# EAGLE design XOR (EAGLE 7.1.0)
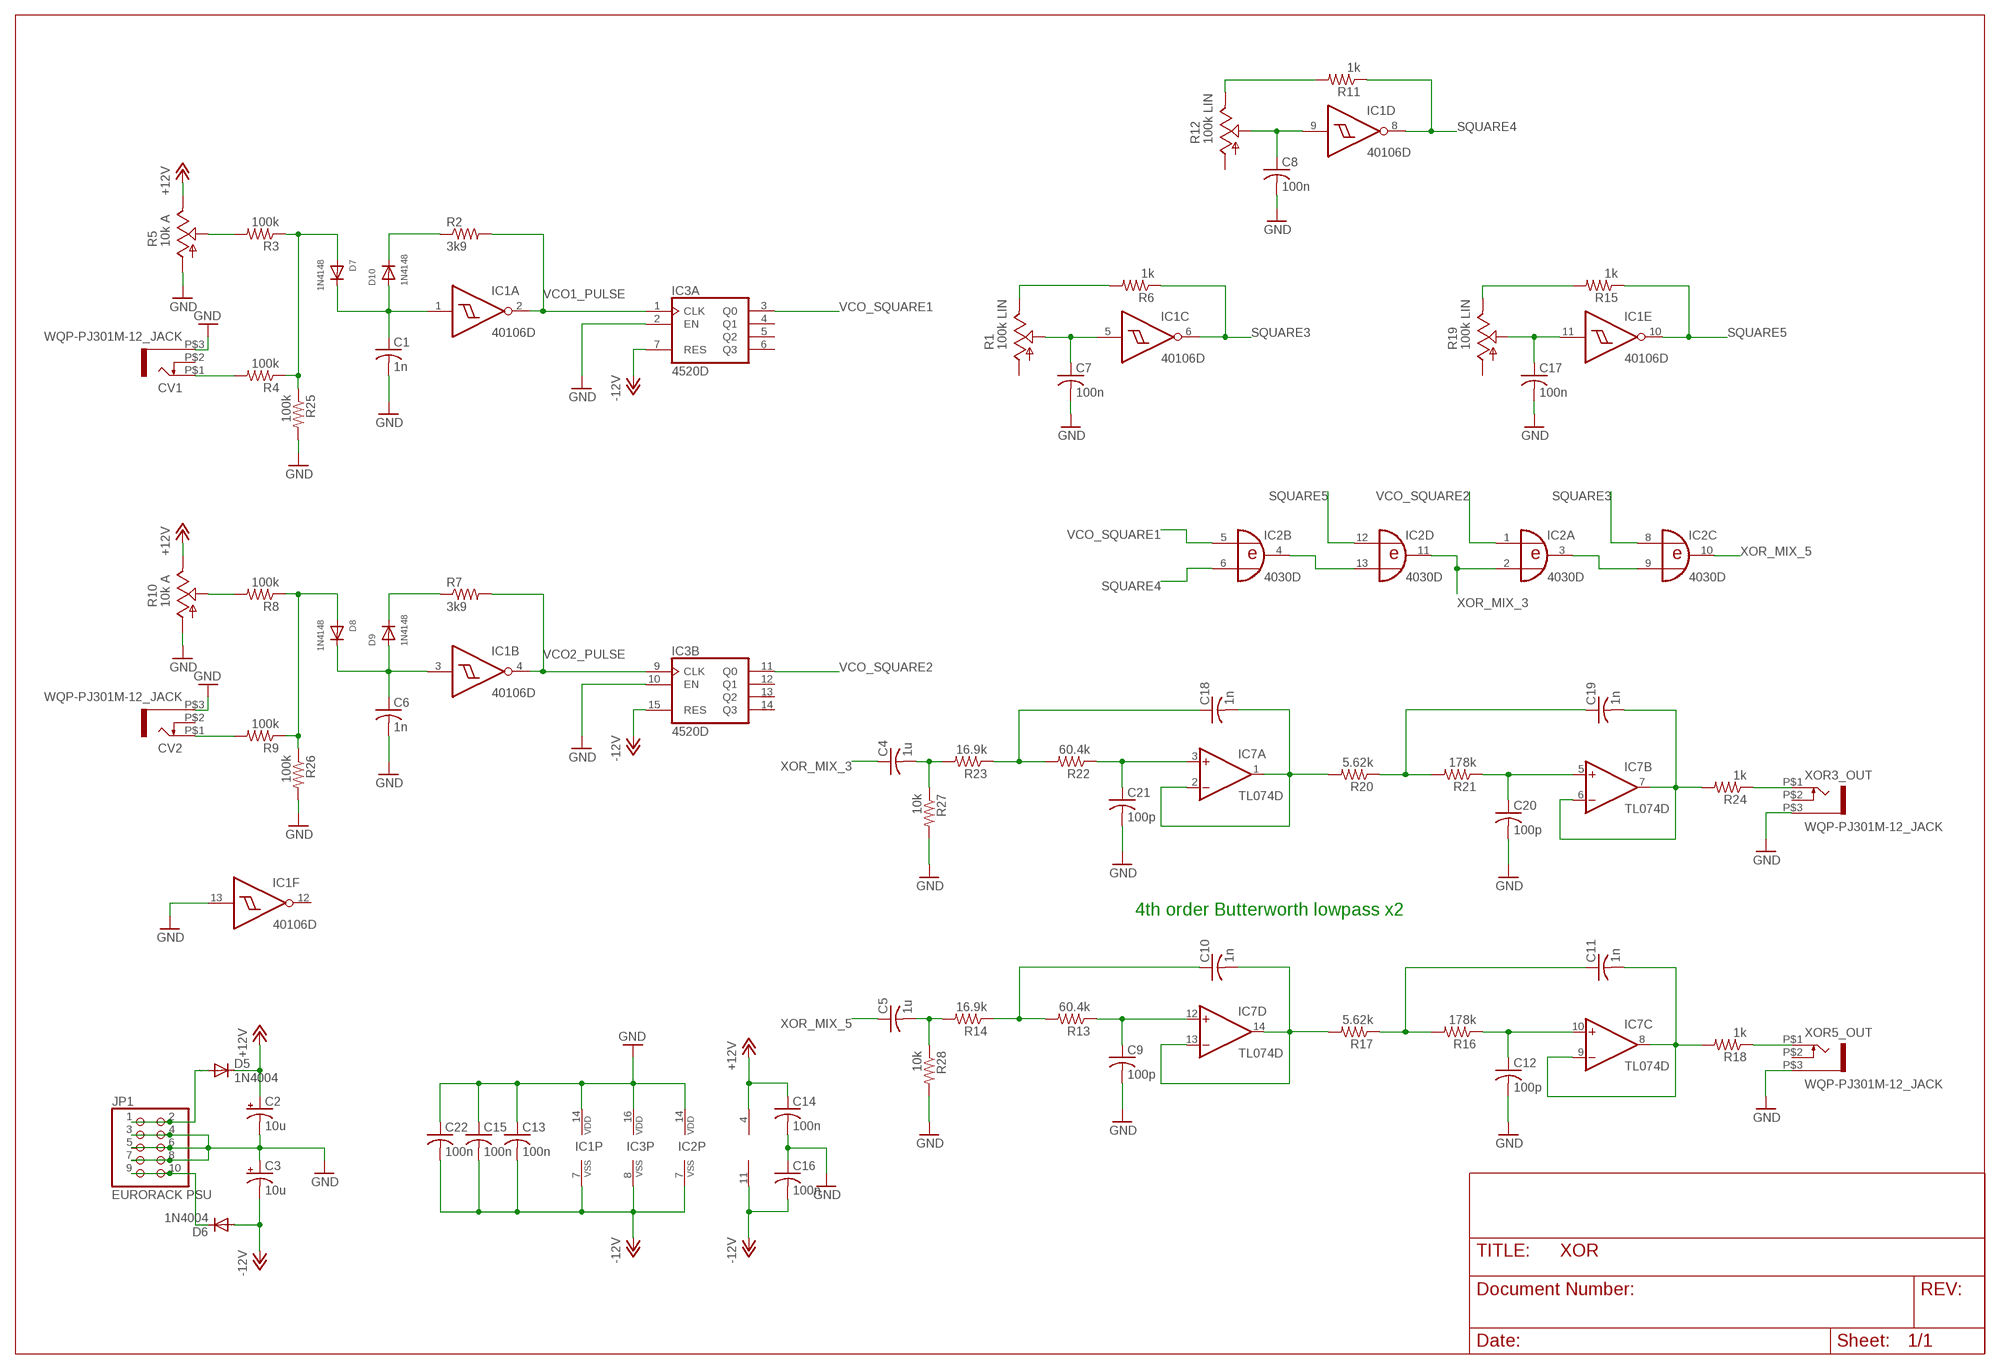
[diagram p0: schematic, sheet 1]

## Parts
C1  1n  C-USC0603K  [C0603K]
C2  10u  CPOL-USD  [PANASONIC_D]
C3  10u  CPOL-USD  [PANASONIC_D]
C4  1u  C-USC0603K  [C0603K]
C5  1u  C-USC0603K  [C0603K]
C6  1n  C-USC0603K  [C0603K]
C7  100n  C-USC0603K  [C0603K]
C8  100n  C-USC0603K  [C0603K]
C9  100p  C-USC0603K  [C0603K]
C10  1n  C-USC0603K  [C0603K]
C11  1n  C-USC0603K  [C0603K]
C12  100p  C-USC0603K  [C0603K]
C13  100n  C-USC0603K  [C0603K]
C14  100n  C-USC0603K  [C0603K]
C15  100n  C-USC0603K  [C0603K]
C16  100n  C-USC0603K  [C0603K]
C17  100n  C-USC0603K  [C0603K]
C18  1n  C-USC0603K  [C0603K]
C19  1n  C-USC0603K  [C0603K]
C20  100p  C-USC0603K  [C0603K]
C21  100p  C-USC0603K  [C0603K]
C22  100n  C-USC0603K  [C0603K]
CV1  WQP-PJ301M-12_JACK  [WQP-PJ301M-12_JACK]
CV2  WQP-PJ301M-12_JACK  [WQP-PJ301M-12_JACK]
D5  1N4004  DIODE-DO214AA  [DO214AA]
D6  1N4004  DIODE-DO214AA  [DO214AA]
D7  1N4148  DIODESOD-323F  [SOD-323F]
D8  1N4148  DIODESOD-323F  [SOD-323F]
D9  1N4148  DIODESOD-323F  [SOD-323F]
D10  1N4148  DIODESOD-323F  [SOD-323F]
IC1  40106D  [SO14]
IC2  4030D  [SO14]
IC3  4520D  [SO16]
IC7  TL074D  [SO14]
JP1  EURORACK PSU  PINHD-2X5  [2X05]
R1  100k LIN  POT_USVERTICAL  [ALPS_POT_VERTICAL]
R2  3k9  R-US_R0603  [R0603]
R3  100k  R-US_R0603  [R0603]
R4  100k  R-US_R0603  [R0603]
R5  10k A  POT_USVERTICAL  [ALPS_POT_VERTICAL]
R6  1k  R-US_R0603  [R0603]
R7  3k9  R-US_R0603  [R0603]
R8  100k  R-US_R0603  [R0603]
R9  100k  R-US_R0603  [R0603]
R10  10k A  POT_USVERTICAL  [ALPS_POT_VERTICAL]
R11  1k  R-US_R0603  [R0603]
R12  100k LIN  POT_USVERTICAL  [ALPS_POT_VERTICAL]
R13  60.4k  R-US_R0603  [R0603]
R14  16.9k  R-US_R0603  [R0603]
R15  1k  R-US_R0603  [R0603]
R16  178k  R-US_R0603  [R0603]
R17  5.62k  R-US_R0603  [R0603]
R18  1k  R-US_R0603  [R0603]
R19  100k LIN  POT_USVERTICAL  [ALPS_POT_VERTICAL]
R20  5.62k  R-US_R0603  [R0603]
R21  178k  R-US_R0603  [R0603]
R22  60.4k  R-US_R0603  [R0603]
R23  16.9k  R-US_R0603  [R0603]
R24  1k  R-US_R0603  [R0603]
R25  100k  R-US_R0603  [R0603]
R26  100k  R-US_R0603  [R0603]
R27  10k  R-US_R0603  [R0603]
R28  10k  R-US_R0603  [R0603]
XOR3_OUT  WQP-PJ301M-12_JACK  [WQP-PJ301M-12_JACK]
XOR5_OUT  WQP-PJ301M-12_JACK  [WQP-PJ301M-12_JACK]

## Nets
+12V: C2.+ C14.1 D5.C IC7.4(P:V+) R5.P$1(E) R10.P$1(E)
-12V: C3.- C13.2 C15.2 C16.2 C22.2 D6.A IC1.7(P:VSS) IC2.7(P:VSS) IC3.7(A:RES) IC3.8(P:VSS) IC3.15(B:RES) IC7.11(P:V-)
GND: C1.2 C2.- C3.+ C6.2 C7.2 C8.2 C9.2 C12.2 C13.1 C14.2 C15.1 C16.1 C17.2 C20.2 C21.2 C22.1 CV1.P$3 CV2.P$3 IC1.13(F:I) IC1.14(P:VDD) IC2.14(P:VDD) IC3.2(A:EN) IC3.10(B:EN) IC3.16(P:VDD) JP1.3 JP1.4 JP1.5 JP1.6 JP1.7 JP1.8 R5.P$3(A) R10.P$3(A) R25.2 R26.2 R27.2 R28.2 XOR3_OUT.P$3 XOR5_OUT.P$3
N$1: R3.2 R5.P$2(S)
N$2: CV1.P$1 R4.2
N$3: D7.A R3.1 R4.1 R25.1
N$4: C1.1 D7.C D10.A IC1.1(A:I)
N$5: D10.C R2.1
N$6: R1.P$1(E) R6.2
N$7: R8.2 R10.P$2(S)
N$8: D6.C JP1.9 JP1.10
N$9: D5.A JP1.1 JP1.2
N$10: IC2.3(A:O) IC2.9(C:I1)
N$12: R11.2 R12.P$1(E)
N$13: C6.1 D8.C D9.A IC1.3(B:I)
N$14: C7.1 IC1.5(C:I) R1.P$2(S)
N$15: D9.C R7.1
N$16: C12.1 IC7.10(C:+IN) R16.1
N$17: D8.A R8.1 R9.1 R26.1
N$18: C10.2 IC7.13(D:-IN) IC7.14(D:OUT) R17.2
N$19: CV2.P$1 R9.2
N$20: C8.1 IC1.9(D:I) R12.P$2(S)
N$21: C10.1 R13.2 R14.1
N$22: C9.1 IC7.12(D:+IN) R13.1
N$23: R18.1 XOR5_OUT.P$1
N$24: C17.1 IC1.11(E:I) R19.P$2(S)
N$25: IC2.4(B:O) IC2.13(D:I1)
N$26: R15.2 R19.P$1(E)
N$28: C18.1 R22.2 R23.1
N$29: C18.2 IC7.1(A:OUT) IC7.2(A:-IN) R20.2
N$30: C21.1 IC7.3(A:+IN) R22.1
N$31: C11.1 R16.2 R17.1
N$32: C11.2 IC7.8(C:OUT) IC7.9(C:-IN) R18.2
N$33: C4.2 R23.2 R27.1
N$34: C19.1 R20.1 R21.2
N$35: C20.1 IC7.5(B:+IN) R21.1
N$36: C19.2 IC7.6(B:-IN) IC7.7(B:OUT) R24.2
N$37: R24.1 XOR3_OUT.P$1
N$38: C5.2 R14.2 R28.1
SQUARE3: IC1.6(C:O) IC2.8(C:I0) R6.1
SQUARE4: IC1.8(D:O) IC2.6(B:I1) R11.1
SQUARE5: IC1.10(E:O) IC2.12(D:I0) R15.1
VCO1_PULSE: IC1.2(A:O) IC3.1(A:CLK) R2.2
VCO2_PULSE: IC1.4(B:O) IC3.9(B:CLK) R7.2
VCO_SQUARE1: IC2.5(B:I0) IC3.3(A:Q0)
VCO_SQUARE2: IC2.1(A:I0) IC3.11(B:Q0)
XOR_MIX_3: C4.1 IC2.2(A:I1) IC2.11(D:O)
XOR_MIX_5: C5.1 IC2.10(C:O)
Unconnected: CV1.P$2 CV2.P$2 IC1.12(F:O) IC3.4(A:Q1) IC3.5(A:Q2) IC3.6(A:Q3) IC3.12(B:Q1) IC3.13(B:Q2) IC3.14(B:Q3) R1.P$3(A) R12.P$3(A) R19.P$3(A) XOR3_OUT.P$2 XOR5_OUT.P$2

## Notes on the sheet
- 4th order Butterworth lowpass x2

## Library data of the parts
C1 C4-C22 = rcl:C-US: CAPACITOR, American symbol
C2 C3 = rcl:CPOL-US: POLARIZED CAPACITOR, American symbol
CV1 CV2 XOR3_OUT XOR5_OUT = thonkiconn:WQP-PJ301M-12_JACK
D5 D6 = diode:DIODE-: DIODE
D7-D10 = adafruit:DIODE: Diode SMADIODE - SMA Surface Mount Package 20V 1A Schottky Diode Digikey: 641-1014-6-ND DO-1N4148 - Through Hole Small Current Diode SOD-123 20V 1 A (.5mV Vf) Schottky Diode - Digikey: MBRX120TPMSCT-ND SOD-323 10V 570mA (.38mV Vf, 3ns) Schottky Diode - Digikey: ZLLS410CT-ND SOD-523 30V 30mA Schottky Diode (RB751S-40TE61) - Digikey: RB751S-40TE61CT-ND SOT23-R/W - SOT23 Package (R = Solder Paste/Reflow Ovens, W = Hand-Soldering) BAT54Film 40V 300mA - Digikey: 497-7162-1-ND
IC1 = 40xx:40106: Hex SCHMITT TRIGGER
IC2 = 40xx:4030: Quad XOR
IC3 = 45xx:4520: Dual binary up COUNTER
IC7 = linear:TL074: OP AMP
JP1 = pinhead:PINHD-2X5: PIN HEADER
R1 R5 R10 R12 R19 = pot-alps:POT_US
R2-R4 R6-R9 R11 R13-R18 R20-R28 = rcl:R-US_: RESISTOR, American symbol

## Board
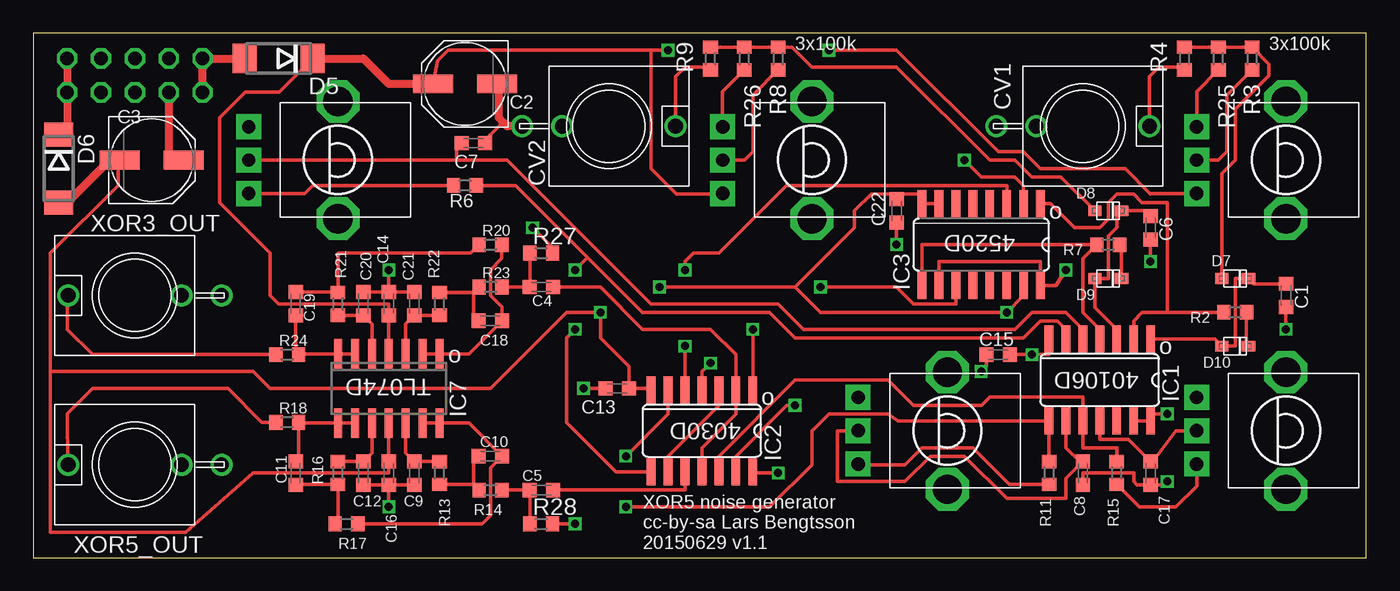
[diagram p1: board, top side]
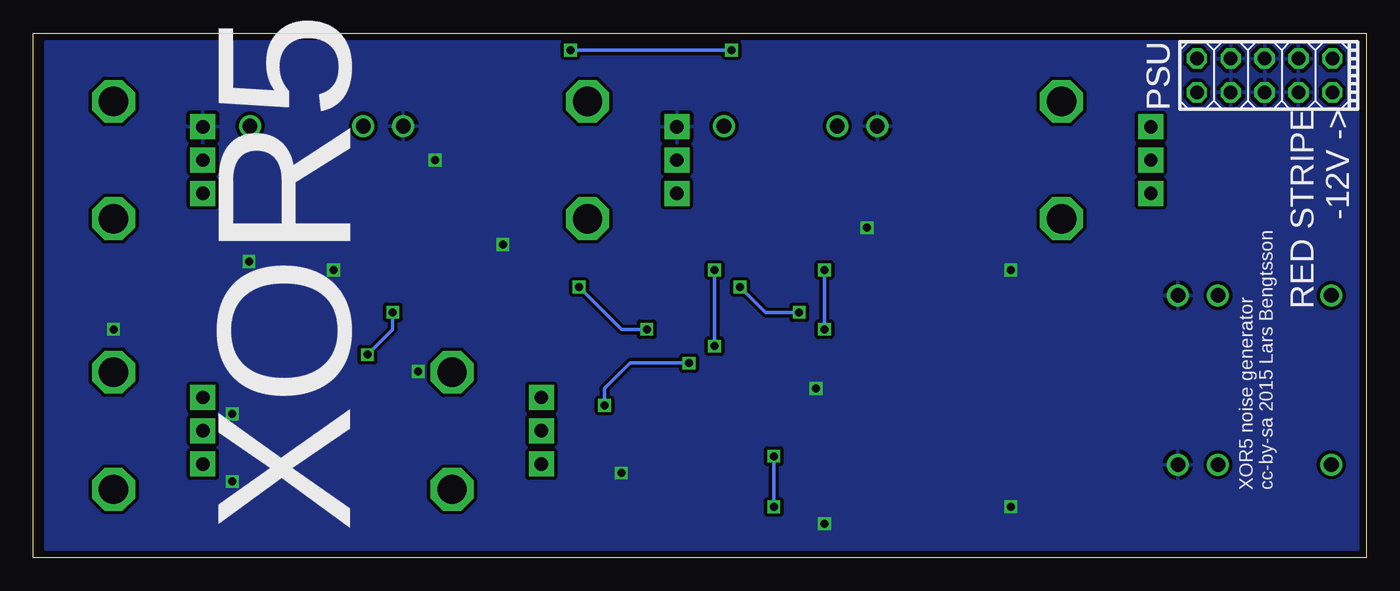
[diagram p2: board, bottom side, seen from below]

Size 100 x 39.36 mm. Coordinates in mm from the lower left corner, seen from the top.
Outline: 0,0 100,0 100,39.36 0,39.36 0,0
Copper layers (1*16): Top 0.0356mm / dielectric 1.5011mm / Bottom 0.0356mm
Design rules "LaenPCBOrder *": minimum track width 6mil, minimum drill 13mil, track to track 6mil, track to pad 6mil, pad to pad 6mil, via to via 6mil, smd to smd 6mil, copper to edge 15mil, drill to drill 6mil, minimum pad ring 7mil, minimum via ring 7mil, stop-mask expansion 3mil, vias tented up to drill 0mil, thermal gap 12mil

### Footprints (pad centres in the part's own frame; a part is rotated, then mirrored left to right if it is on the bottom)
C0603K = smd 1.05 x 1.08: 1 -0.875,0; 2 0.875,0
PANASONIC_D = smd 3 x 1.4: + 2.4,0; - -2.4,0
WQP-PJ301M-12_JACK = drill 1.1: P$1 0,5; P$2 0,-3.5; P$3 0,-6.5
DO214AA = smd 1.8 x 2.2: A 2.55,0; C -2.55,0
SOD-323F = smd 1 x 0.8: A -1,0; C 1,0
SO14 = smd 0.66 x 2.032: 1 -3.81,-3.073; 2 -2.54,-3.073; 3 -1.27,-3.073; 4 0,-3.073; 5 1.27,-3.073; 6 2.54,-3.073; 7 3.81,-3.073; 8 3.81,3.073; 9 2.54,3.073; 10 1.27,3.073; 11 0,3.073; 12 -1.27,3.073; 13 -2.54,3.073; 14 -3.81,3.073
SO16 = smd 0.66 x 2.032: 1 -4.445,-3.073; 2 -3.175,-3.073; 3 -1.905,-3.073; 4 -0.635,-3.073; 5 0.635,-3.073; 6 1.905,-3.073; 7 3.175,-3.073; 8 4.445,-3.073; 9 4.445,3.073; 10 3.175,3.073; 11 1.905,3.073; 12 0.635,3.073; 13 -0.635,3.073; 14 -1.905,3.073; 15 -3.175,3.073; 16 -4.445,3.073
SO14' = smd 0.6 x 2.2: 1 -3.81,-2.6; 2 -2.54,-2.6; 3 -1.27,-2.6; 4 0,-2.6; 5 1.27,-2.6; 6 2.54,-2.6; 7 3.81,-2.6; 8 3.81,2.6; 9 2.54,2.6; 10 1.27,2.6; 11 0,2.6; 12 -1.27,2.6; 13 -2.54,2.6; 14 -3.81,2.6
2X05 = drill 1.016 octagon: 1 -5.08,-1.27; 2 -5.08,1.27; 3 -2.54,-1.27; 4 -2.54,1.27; 5 0,-1.27; 6 0,1.27; 7 2.54,-1.27; 8 2.54,1.27; 9 5.08,-1.27; 10 5.08,1.27
ALPS_POT_VERTICAL = drill 1 pad 1.88 square: P$1 -2.5,6.7; P$2 0,6.7; P$3 2.5,6.7 | drill 2.2 pad 3.175 octagon: P$4 -4.4,0; P$5 4.4,0
R0603 = smd 1 x 1.1: 1 -0.85,0; 2 0.85,0

### Placement (x,y rotation side)
C1  93.98,19.68 270 top
C2  32.38,35.56 180 top
C3  8.89,29.84 0 top
C4  38.1,20.32 180 top
C5  38.1,5.08 180 top
C6  83.82,24.76 270 top
C7  33.02,31.11 0 top
C8  78.74,6.35 270 top
C9  28.57,6.35 270 top
C10  34.29,7.62 0 top
C11  19.68,6.35 90 top
C12  24.77,6.35 270 top
C13  43.81,12.7 0 top
C14  26.67,19.05 90 top
C15  72.39,15.24 0 top
C16  26.67,6.35 90 top
C17  83.82,6.35 270 top
C18  34.29,17.78 0 top
C19  19.68,19.05 270 top
C20  24.77,19.05 90 top
C21  28.57,19.05 90 top
C22  64.77,26.04 90 top
CV1  78.74,32.39 270 top
CV2  43.18,32.39 270 top
D5  18.41,37.47 180 top
D6  1.91,29.21 270 top
D7  90.17,20.95 0 top
D8  80.64,26.04 0 top
D9  80.64,20.95 0 top
D10  90.17,15.88 0 top
IC1  80.01,13.34 180 top
IC2  50.16,9.53 180 top
IC3  71.12,23.49 180 top
IC7  TL074D  [SO14']  26.67,12.7 180 top
JP1  7.62,36.2 0 bottom
R1  22.86,29.84 90 top
R2  90.17,18.41 180 top
R3  91.44,37.47 270 top
R4  86.36,37.47 270 top
R5  93.98,29.84 90 top
R6  32.38,27.94 180 top
R7  80.64,23.49 180 top
R8  55.88,37.47 270 top
R9  50.8,37.47 270 top
R10  58.42,29.84 90 top
R11  76.2,6.35 270 top
R12  68.58,9.53 90 top
R13  30.48,6.35 270 top
R14  34.29,5.08 0 top
R15  81.28,6.35 270 top
R16  22.86,6.35 270 top
R17  23.5,2.54 0 top
R18  19.05,10.16 0 top
R19  93.98,9.53 90 top
R20  34.29,23.49 0 top
R21  22.86,19.05 90 top
R22  30.48,19.05 90 top
R23  34.29,20.32 0 top
R24  19.05,15.24 0 top
R25  88.9,37.47 270 top
R26  53.34,37.47 270 top
R27  38.1,22.86 0 top
R28  38.1,2.54 0 top
XOR3_OUT  7.62,19.68 90 top
XOR5_OUT  7.62,6.99 90 top

### Tracks (layer width: path | path; a pad name or v marks a point on that pad's centre or on a via)
+12V  (via drill 0.6)
  Top 0.254: IC7.4 C14.1 26.67,19.05 18.41,19.05 17.78,19.68 17.78,22.86 13.97,26.67 13.97,33.02 15.88,34.93 18.43,34.93 D5.C | R5.P$1 83.86,27.34 83.82,27.3 81.92,29.21 75.56,29.21 74.3,30.48 72.39,30.48 64.77,38.1 v59.69,38.1 | 46.35,38.1 46.35,29.21 48.26,27.3 51.68,27.3 R10.P$1 | C2.+ 30.34,37.32 31.11,38.1 46.35,38.1 | v47.62,38.1 46.35,38.1
  Top 0.61: D5.C 24.77,37.47 26.67,35.56 C2.+
  Bottom 0.254: v59.69,38.1 v47.62,38.1
-12V  (via drill 0.6)
  Top 0.254: IC7.11 C16.2 26.67,6.35 16.51,6.35 11.43,1.91 1.27,1.91 1.27,13.97 | IC3.15 74.3,19.68 v73.03,18.41 59.05,18.41 57.15,20.32 | IC1.7 76.2,15.24 v74.93,15.24 C15.2 | IC3.7 IC3.8 66.67,27.3 64.77,27.3 | 1.27,13.97 1.27,22.86 6.35,27.94 6.35,29.7 C3.- | 57.15,20.32 v46.99,20.32 | 1.27,13.97 16.51,13.97 17.78,12.7 34.29,12.7 40.01,18.41 v42.55,18.41 42.55,16.51 44.69,14.37 C13.2 46.25,12.7 IC2.7 | C22.2 64.77,27.3 | 57.15,20.32 61.59,24.76 61.59,26.04 62.87,27.3 64.77,27.3
  Top 0.61: D6.A 2.53,26.66 5.71,29.84 C3.-
  Bottom 0.254: v73.03,18.41 73.03,17.14 v74.93,15.24 | v46.99,20.32 45.09,18.41 v42.55,18.41
GND  (via drill 0.6)
  Top 0.254: C14.2 v26.67,21.59 | C16.1 v26.67,3.81 | C9.2 C16.1 | C16.1 C12.2 | C20.2 C14.2 | C14.2 C21.2 | R10.P$3 51.72,35 R26.2 | R5.P$3 87.28,35 R25.2 | v85.09,10.79 83.82,10.79 IC1.14 IC1.13 | C8.2 78.74,6.35 82.55,6.35 82.55,5.71 82.79,5.48 C17.2 84.85,5.48 v85.09,5.71 | C1.2 v93.98,17.14 | C6.2 v83.82,22.22 | v77.47,21.59 76.73,20.42 IC3.16 75.56,22.22 67.94,22.22 IC3.10 | v55.88,6.35 53.98,6.35 IC2.14 | C13.1 v41.27,12.7 | C22.1 v64.77,23.49 | C15.1 71.52,14.37 v71.12,13.97 | IC3.2 74.3,27.94 73.66,28.57 71.12,28.57 v69.85,29.84 | C7.2 34.29,31.75 35.24,32.7 | R28.2 v40.64,2.54 | R27.2 38.95,23.28 v37.47,24.76
  Top 0.61: C2.- 34.92,35.07 34.92,33.02 35.24,32.7 35.56,32.39 CV2.P$3 | JP1.3 10.16,29.84 C3.+
  pour Bottom (isolate 0.254): 0.64,38.73 99.06,38.73 99.06,0.64 0.64,0.64
N$1
  Top 0.254: R5.P$2 88.9,29.84 89.53,30.48 89.53,34.71 R3.2
N$2
  Top 0.254: CV1.P$1 83.74,36.12 84.45,36.83 86.14,36.83 R4.2
N$3
  Top 0.254: R4.1 R25.1 R3.1 92.71,37.05 92.71,36.2 90.17,33.66 90.17,29.84 89.17,28.84 D7.A
N$4
  Top 0.254: IC1.1 88.64,16.41 D10.A 90.17,15.88 90.17,20.95 D7.C 91.56,20.56 C1.1
N$5
  Top 0.254: R2.1 91.02,16.02 D10.C
N$6
  Top 0.254: R1.P$1 20.36,27.34 20.95,27.94 R6.2
N$7
  Top 0.254: R10.P$2 53.34,29.84 53.98,30.48 53.98,34.71 R8.2
N$8
  Top 0.61: JP1.10 JP1.9 2.54,32.4 D6.C
N$9
  Top 0.61: JP1.1 JP1.2 D5.A
N$10
  Top 0.254: IC2.3 51.44,11.43 47.62,7.62 IC2.9
N$12
  Top 0.254: R11.2 73.24,5.5 70.48,8.26 66.67,8.26 65.41,6.99 61.92,6.99 R12.P$1
N$13
  Top 0.254: IC1.3 81.28,17.14 79.64,18.78 D9.A 80.64,20.95 80.64,24.13 81.28,24.76 81.28,25.67 D8.C 83.42,26.04 C6.1
N$14
  Top 0.254: R1.P$2 31.75,29.84 | 31.75,29.84 35.56,29.84 46.35,19.05 55.88,19.05 57.78,17.14 73.66,17.14 74.93,18.41 77.47,18.41 78.74,17.14 IC1.5 | C7.1 31.75,31.11 31.75,29.84
N$15
  Top 0.254: D9.C 81.64,23.34 R7.1
N$16
  Top 0.254: IC7.10 25.4,7.86 C12.1 22.89,7.23 R16.1
N$17
  Top 0.254: R9.1 R26.1 R8.1 56.94,38.32 58.42,36.83 64.77,36.83 71.75,29.84 73.66,29.84 74.93,28.57 77.11,28.57 D8.A
N$18
  Top 0.254: R17.2 33.66,2.54 34.29,3.17 34.29,6.75 C10.2 32.69,10.1 IC7.14 IC7.13
N$19
  Top 0.254: CV2.P$1 48.18,36.12 48.9,36.83 50.59,36.83 R9.2
N$20
  Top 0.254: IC1.9 77.47,8.26 78.5,7.23 C8.1 77.47,5.96 77.47,4.45 73.03,4.45 69.85,7.62 67.31,7.62 65.41,5.71 60.33,5.71 60.33,9.53 R12.P$2
N$21
  Top 0.254: R13.2 33.02,5.5 | 33.02,5.5 R14.1 | 33.02,5.5 33.02,7.23 C10.1
N$22
  Top 0.254: IC7.12 27.94,7.86 C9.1 30.45,7.23 R13.1
N$23
  Top 0.254: R18.1 17.14,10.16 14.61,12.7 4.45,12.7 2.54,10.79 2.54,9.61 XOR5_OUT.P$1
N$24
  Top 0.254: R19.P$2 85.72,9.53 83.82,6.99 84.22,7.62 C17.1 82.16,8.89 80.01,8.89 IC1.11
N$25  (via drill 0.6)
  Top 0.254: IC2.4 50.16,13.97 v50.8,14.61 | IC2.13 52.7,7.62 56.52,11.43 v57.15,11.43
  Bottom 0.254: v50.8,14.61 55.24,14.61 57.15,12.7 v57.15,11.43
N$26
  Top 0.254: R19.P$1 87.28,5.37 85.72,3.81 82.97,3.81 R15.2
N$28
  Top 0.254: R22.2 33.02,19.9 | 33.02,19.9 R23.1 | 33.02,19.9 33.02,18.17 C18.1
N$29
  Top 0.254: IC7.1 IC7.2 32.69,15.3 C18.2 35.16,18.81 34.29,19.68 34.29,21.59 35.14,22.44 R20.2
N$30
  Top 0.254: IC7.3 27.94,17.54 C21.1 30.45,18.17 R22.1
N$31
  Top 0.254: R17.1 22.86,2.75 R16.2 19.71,5.5 C11.1
N$32
  Top 0.254: IC7.9 IC7.8 19.96,10.1 R18.2 19.9,7.44 C11.2
N$33
  Top 0.254: R23.2 C4.2 37.25,20.34 R27.1
N$34
  Top 0.254: C19.1 22.84,19.92 R21.2 22.86,22.86 32.8,22.86 R20.1
N$35
  Top 0.254: IC7.5 25.4,17.54 C20.1 22.89,18.17 R21.1
N$36
  Top 0.254: IC7.6 IC7.7 19.84,15.3 | C19.2 19.68,15.46 R24.2 19.84,15.3 | 19.68,15.3 19.84,15.3
N$37
  Top 0.254: R24.1 4.45,15.24 2.54,17.14 2.54,19.6 XOR3_OUT.P$1
N$38
  Top 0.254: R14.2 C5.2 37.25,5.06 R28.1
SQUARE3  (via drill 0.6)
  Top 0.254: IC1.6 77.47,17.14 76.83,17.78 75.56,17.78 74.3,16.51 57.15,16.51 55.24,18.41 45.72,18.41 41.59,22.54 | R6.1 36.2,27.94 41.59,22.54 | IC2.8 43.71,6.45 40.01,10.16 40.01,16.51 v40.64,17.14 | v40.64,21.59 41.59,22.54
  Bottom 0.254: v40.64,17.14 v40.64,21.59
SQUARE4  (via drill 0.6)
  Top 0.254: R11.1 IC1.8 64.87,10.26 64.14,10.79 59.69,10.79 58.42,9.53 58.42,6.99 55.24,3.81 v44.45,3.81 | v44.45,7.62 47.62,10.79 IC2.6
  Bottom 0.254: v44.45,3.81 v44.45,7.62
SQUARE5
  Top 0.254: R15.1 81.28,8.26 78.74,8.26 IC1.10 78.74,12.06 71.75,12.06 71.12,11.43 66.04,11.43 64.14,13.34 57.15,13.34 51.44,7.62 IC2.12
VCO1_PULSE
  Top 0.254: IC1.2 82.55,17.78 83.19,18.41 85.09,18.41 | 85.09,18.41 R2.2 | IC3.1 76.3,26.57 78.11,24.76 80.01,24.76 80.64,25.4 80.64,26.67 81.28,27.3 82.55,27.3 83.19,26.67 85.09,26.67 85.09,18.41
VCO2_PULSE
  Top 0.254: IC1.4 80.01,17.14 78.74,18.41 78.74,22.44 R7.2 66.67,23.49 IC3.9
VCO_SQUARE1  (via drill 0.6)
  Top 0.254: IC3.3 73.03,27.94 56.52,27.94 51.44,22.86 49.53,22.86 48.9,22.22 v48.9,21.59 | v48.9,15.88 IC2.5
  Bottom 0.254: v48.9,21.59 v48.9,15.88
VCO_SQUARE2  (via drill 0.6)
  Top 0.254: IC3.11 69.22,19.05 66.04,19.05 64.77,20.32 v59.05,20.32 | v53.98,17.14 IC2.1
  Bottom 0.254: v59.05,20.32 55.88,17.14 v53.98,17.14
XOR_MIX_3
  Top 0.254: IC2.11 50.16,8.26 52.7,10.79 IC2.2 52.7,15.24 50.8,17.14 45.72,17.14 42.55,20.32 C4.1
XOR_MIX_5
  Top 0.254: IC2.10 48.9,5.08 C5.1

### Text on the board
tNames: 3x100k | 3x100k | o | o | o | o | XOR5 noise generator / cc-by-sa Lars Bengtsson / 20150629 v1.1
bNames: PSU | PSU | RED STRIPE / -12V -> | XOR5 noise generator / cc-by-sa 2015 Lars Bengtsson | XOR5